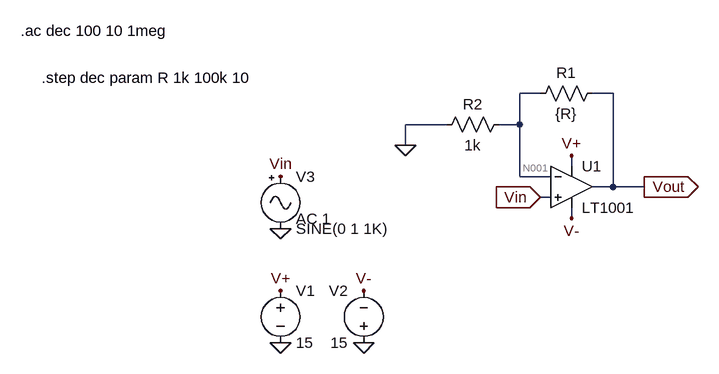
[diagram p0: schematic Comando Step.asc]
Comando Step.asc, the LTspice schematic file:
Version 4
SHEET 1 928 680
WIRE 624 -384 592 -384
WIRE 736 -384 704 -384
WIRE 480 -336 416 -336
WIRE 592 -336 592 -384
WIRE 592 -336 560 -336
WIRE 416 -304 416 -336
WIRE 672 -272 672 -288
WIRE 592 -256 592 -336
WIRE 640 -256 592 -256
WIRE 736 -240 736 -384
WIRE 736 -240 704 -240
WIRE 784 -240 736 -240
WIRE 640 -224 624 -224
WIRE 672 -192 672 -208
FLAG 224 0 0
FLAG 352 0 0
FLAG 224 -80 V+
FLAG 352 -80 V-
FLAG 672 -288 V+
FLAG 672 -192 V-
FLAG 224 -176 0
FLAG 224 -256 Vin
FLAG 624 -224 Vin
IOPIN 624 -224 In
FLAG 416 -304 0
FLAG 784 -240 Vout
IOPIN 784 -240 Out
SYMBOL voltage 224 -96 R0
WINDOW 123 0 0 Left 0
WINDOW 39 0 0 Left 0
SYMATTR InstName V1
SYMATTR Value 15
SYMBOL voltage 352 16 R180
WINDOW 0 24 96 Left 2
WINDOW 3 24 16 Left 2
WINDOW 123 0 0 Left 0
WINDOW 39 0 0 Left 0
SYMATTR InstName V2
SYMATTR Value 15
SYMBOL OpAmps\\LT1001 672 -304 R0
SYMATTR InstName U1
SYMBOL Misc\\signal 224 -272 R0
WINDOW 123 24 81 Left 2
WINDOW 39 0 0 Left 0
SYMATTR Value2 AC 1
SYMATTR InstName V3
SYMBOL res 720 -400 R90
WINDOW 0 0 56 VBottom 2
WINDOW 3 32 56 VTop 2
SYMATTR InstName R1
SYMATTR Value {R}
SYMBOL res 576 -352 R90
WINDOW 0 0 56 VBottom 2
WINDOW 3 32 56 VTop 2
SYMATTR InstName R2
SYMATTR Value 1k
TEXT -176 -480 Left 2 !.ac dec 100 10 1meg
TEXT -144 -408 Left 2 !.step dec param R 1k 100k 10

The netlist it stands for:
* Comando Step.asc
V1 V+ 0 15
V2 0 V- 15
XU1 Vin N001 V+ V- Vout LT1001  ; pins In+ In- V+ V- OUT
V3 Vin 0 SINE(0 1 1K) AC 1
R1 Vout N001 {R}
R2 N001 0 1k
.ac dec 100 10 1meg
.step dec param R 1k 100k 10
.lib LTC.lib
.backanno
.end

* Results of the author's LTspice run, read from the files saved beside the schematic
* Operating Point (first step), zero values left out:
*   r = 1 k
*   V(v+) = 15 V
*   V(v-) = -15 V
*   I(V1) = -2.25 mA
*   I(V2) = -2.25 mA
*   Ix(u1:3) = 2.25 mA
*   Ix(u1:4) = -2.25 mA
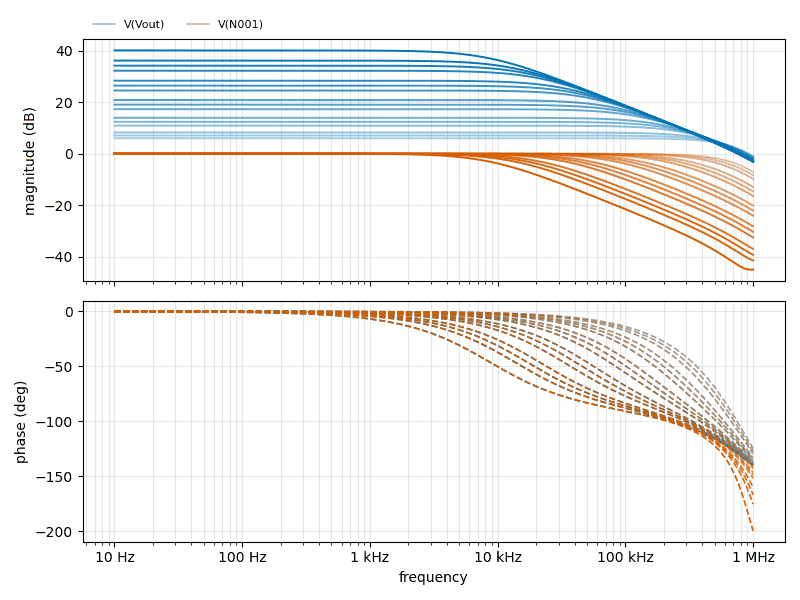
[diagram p1: AC Analysis of Comando Step.asc, plotted from the saved traces]
* AC Analysis, 21 runs:
*   V(Vout) [run 1]: 6.02 dB at 10 Hz, -0.95 dB at 1 MHz, peak 6.02 dB at 10 Hz, 3 dB below the peak at 657.9 kHz
*   V(Vout) [run 2]: 7.08 dB at 10 Hz, -1.18 dB at 1 MHz, peak 7.08 dB at 10 Hz, 3 dB below the peak at 561.5 kHz
*   V(Vout) [run 3]: 8.25 dB at 10 Hz, -1.42 dB at 1 MHz, peak 8.25 dB at 10 Hz, 3 dB below the peak at 469.3 kHz
*   V(Vout) [run 4]: 10.91 dB at 10 Hz, -1.86 dB at 1 MHz, peak 10.91 dB at 10 Hz, 3 dB below the peak at 314 kHz
*   V(Vout) [run 5]: 12.39 dB at 10 Hz, -2.06 dB at 1 MHz, peak 12.39 dB at 10 Hz, 3 dB below the peak at 253.7 kHz
*   V(Vout) [run 6]: 13.95 dB at 10 Hz, -2.23 dB at 1 MHz, peak 13.95 dB at 10 Hz, 3 dB below the peak at 204 kHz
*   V(Vout) [run 7]: 17.28 dB at 10 Hz, -2.52 dB at 1 MHz, peak 17.28 dB at 10 Hz, 3 dB below the peak at 131 kHz
*   V(Vout) [run 8]: 19.03 dB at 10 Hz, -2.63 dB at 1 MHz, peak 19.03 dB at 10 Hz, 3 dB below the peak at 104.7 kHz
*   V(N001) [run 1]: -0.00 dB at 10 Hz, -7.02 dB at 1 MHz, peak -0.00 dB at 10 Hz, 3 dB below the peak at 655.4 kHz
*   V(N001) [run 2]: -0.00 dB at 10 Hz, -8.32 dB at 1 MHz, peak -0.00 dB at 10 Hz, 3 dB below the peak at 559.2 kHz
*   V(N001) [run 3]: -0.00 dB at 10 Hz, -9.74 dB at 1 MHz, peak -0.00 dB at 10 Hz, 3 dB below the peak at 467.4 kHz
*   V(N001) [run 4]: -0.00 dB at 10 Hz, -12.90 dB at 1 MHz, peak -0.00 dB at 10 Hz, 3 dB below the peak at 313 kHz
*   V(N001) [run 5]: -0.00 dB at 10 Hz, -14.60 dB at 1 MHz, peak -0.00 dB at 10 Hz, 3 dB below the peak at 252.9 kHz
*   V(N001) [run 6]: -0.00 dB at 10 Hz, -16.38 dB at 1 MHz, peak -0.00 dB at 10 Hz, 3 dB below the peak at 203.5 kHz
*   V(N001) [run 7]: -0.00 dB at 10 Hz, -20.11 dB at 1 MHz, peak -0.00 dB at 10 Hz, 3 dB below the peak at 130.8 kHz
*   V(N001) [run 8]: -0.00 dB at 10 Hz, -22.05 dB at 1 MHz, peak -0.00 dB at 10 Hz, 3 dB below the peak at 104.5 kHz